# EAGLE design Hydra OSP (EAGLE 8.2.2)
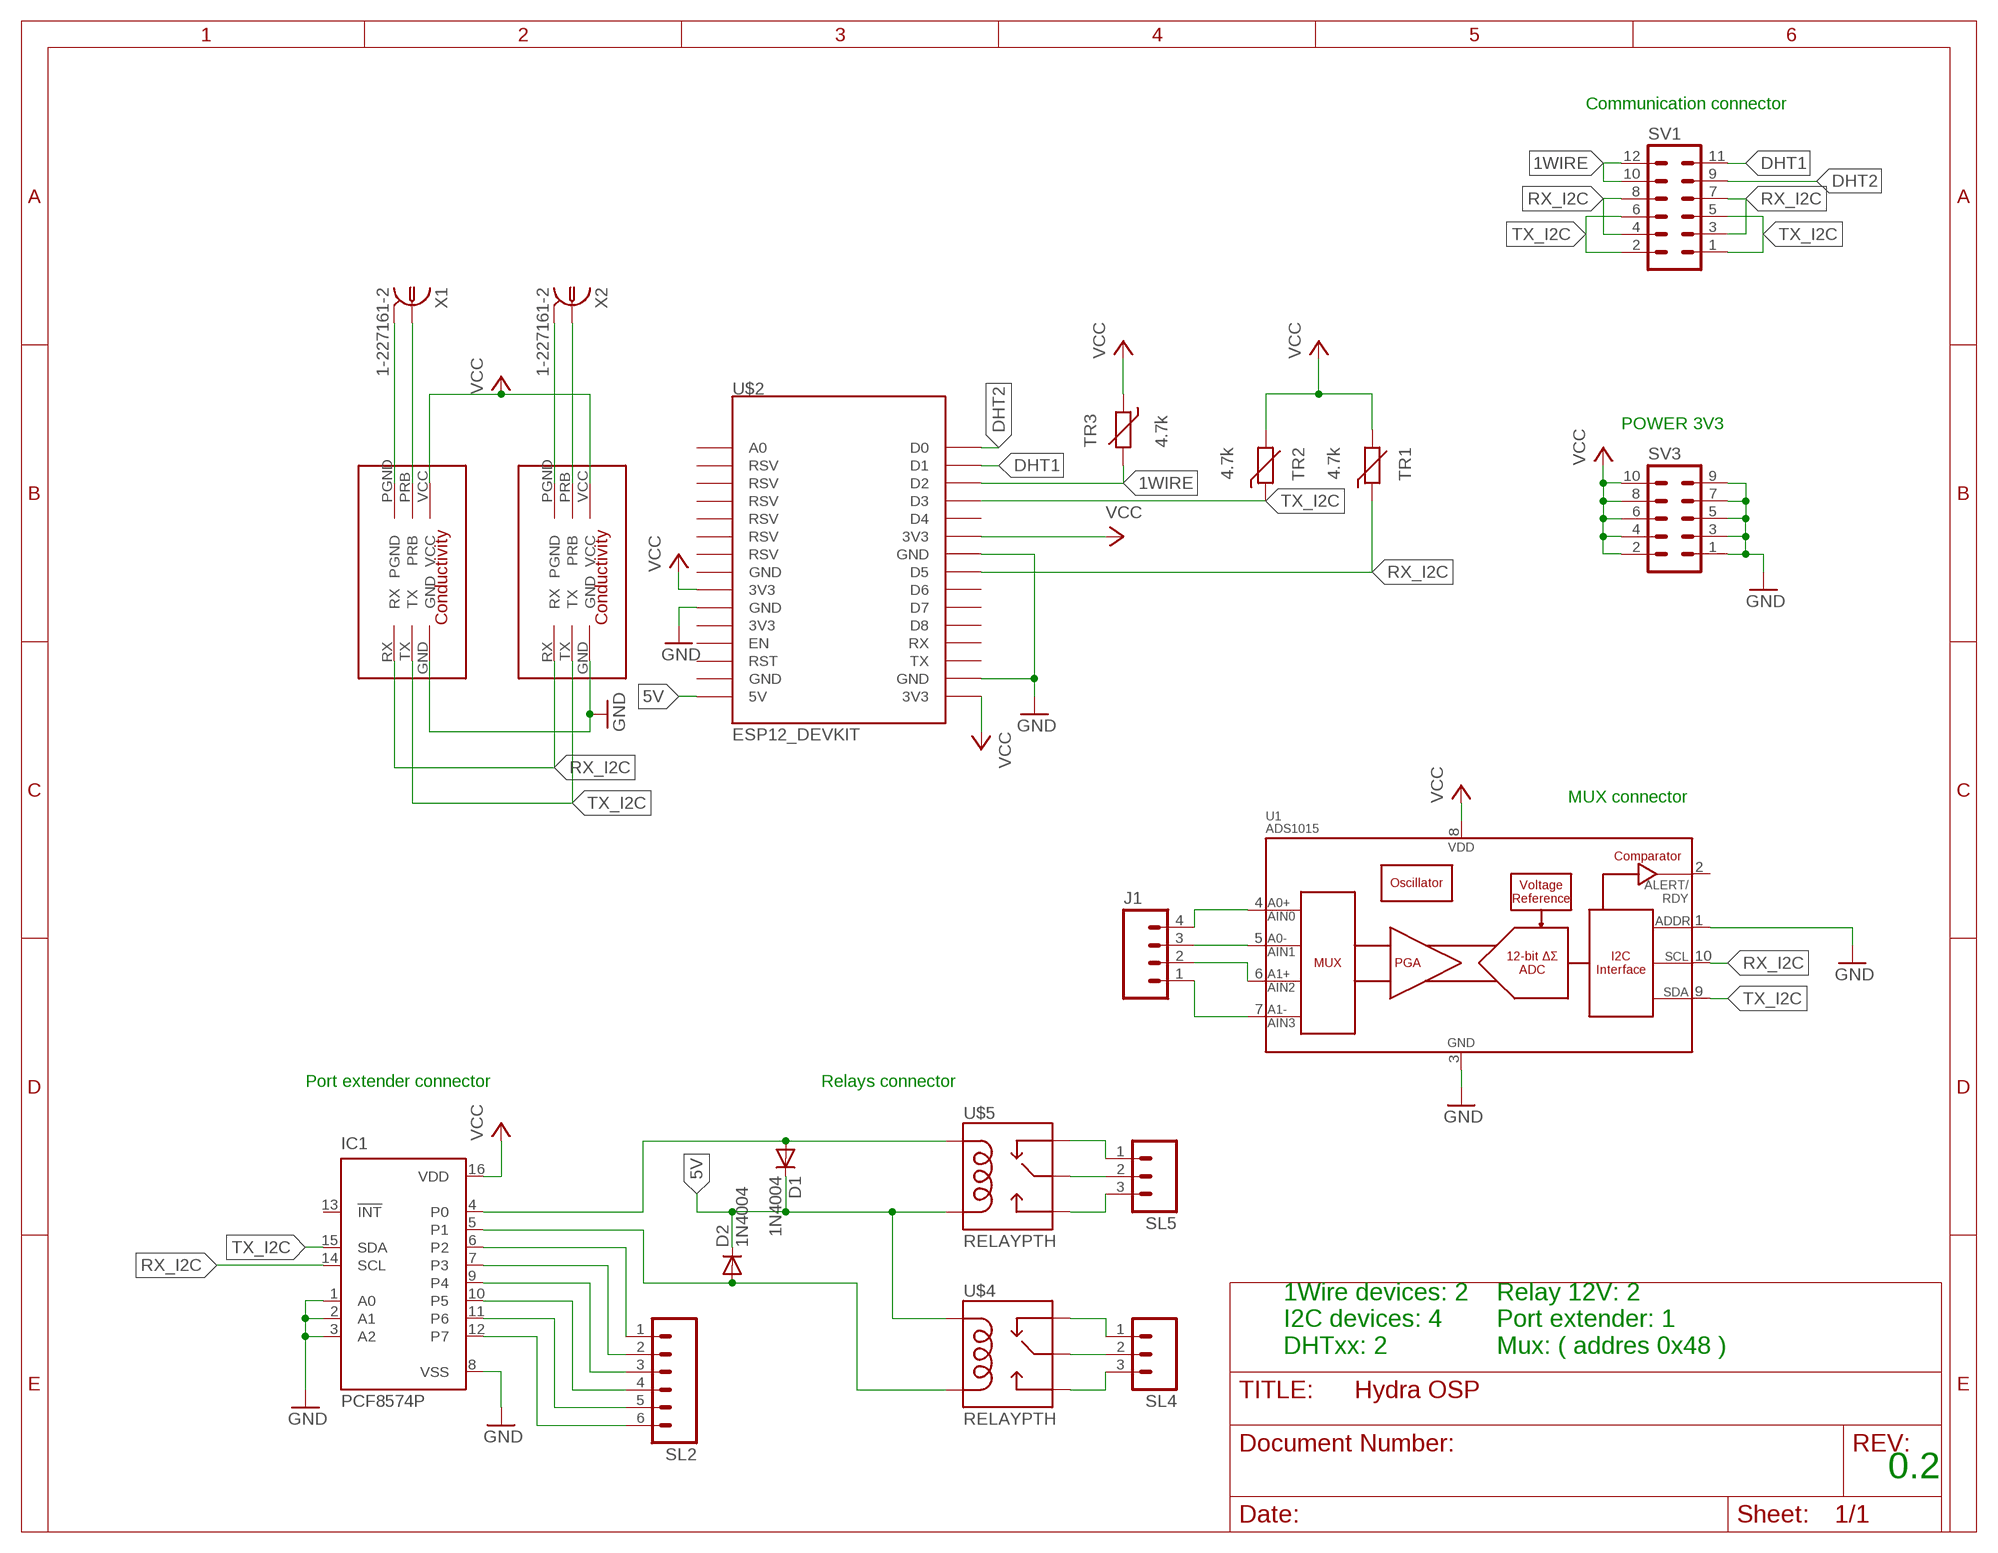
[diagram p0: schematic, sheet 1]

## Parts
D1  1N4004  [DO41-10]
D2  1N4004  [DO41-10]
IC1  PCF8574P  [DIL16]
J1  M04LOCK  [1X04_LOCK]
SL2  M06  [06P]
SL4  M03  [03P]
SL5  M03  [03P]
SV1  MA06-2  [MA06-2]
SV3  MA05-2  [MA05-2]
TR1  4.7k  THERMISTOR_R-5  [R-5]
TR2  4.7k  THERMISTOR_R-5  [R-5]
TR3  4.7k  THERMISTOR_R-5  [R-5]
U1  ADS1015  [MSOP10]
U$1  ATLSCI_COND  [ATLAS_SCI_COND]
U$2  ESP12_DEVKIT  [ESP12_DEVKIT]
U$3  ATLSCI_COND  [ATLAS_SCI_COND]
U$4  RELAYPTH  [SRD-05VDC-SL-C]
U$5  RELAYPTH  [SRD-05VDC-SL-C]
X1  1-227161-2  [AMP_227161]
X2  1-227161-2  [AMP_227161]

## Nets
1WIRE: SV1.10 SV1.12 TR3.2 U$2.D2
5V: D1.C D2.C U$2.5V U$4.COIL1 U$5.COIL0
DHT1: SV1.11 U$2.D1
DHT2: SV1.9 U$2.D0
GND: IC1.1(A0) IC1.2(A1) IC1.3(A2) IC1.8(VSS) SV3.1 SV3.3 SV3.5 SV3.7 SV3.9 U1.1(ADDR) U1.3(VSS) U$1.GND U$2.GND@0(GND) U$2.GND@2(GND) U$2.GND@3(GND) U$3.GND
N$1: U$1.PGND X1.2
N$2: U$1.PRB X1.1
N$3: U$3.PRB X2.1
N$4: U$3.PGND X2.2
N$5: D1.A IC1.4(P0) U$5.COIL1
N$6: D2.A IC1.5(P1) U$4.COIL0
N$7: SL4.1 U$4.SWCLOSED(SWCLOSE)
N$8: SL4.2 U$4.SWCOMMON
N$9: J1.4 U1.4(AIN0)
N$10: J1.3 U1.5(AIN1)
N$11: J1.2 U1.6(AIN2)
N$12: J1.1 U1.7(AIN3)
N$13: IC1.6(P2) SL2.1
N$14: IC1.7(P3) SL2.2
N$15: IC1.9(P4) SL2.3
N$16: IC1.10(P5) SL2.4
N$17: IC1.11(P6) SL2.5
N$18: IC1.12(P7) SL2.6
N$19: SL4.3 U$4.SWOPEN
N$20: SL5.1 U$5.SWCLOSED(SWCLOSE)
N$21: SL5.2 U$5.SWCOMMON
N$22: SL5.3 U$5.SWOPEN
RX_I2C: IC1.14(SCL) SV1.3 SV1.4 SV1.7 SV1.8 TR1.1 U1.10(SCL) U$1.RX U$2.D5 U$3.RX
TX_I2C: IC1.15(SDA) SV1.1 SV1.2 SV1.5 SV1.6 TR2.1 U1.9(SDA) U$1.TX U$2.D3 U$3.TX
VCC: IC1.16(VDD) SV3.2 SV3.4 SV3.6 SV3.8 SV3.10 TR1.2 TR2.2 TR3.1 U1.8(VDD) U$1.VCC U$2.3V3@1(3V3) U$2.3V3@2(3V3) U$2.3V3@3(3V3) U$3.VCC
Unconnected: IC1.13(!INT) U1.2(ALERT/RDY) U$2.3V3@0(3V3) U$2.A0 U$2.D4 U$2.D6 U$2.D7 U$2.D8 U$2.EN U$2.GND@1(GND) U$2.GND@4(GND) U$2.RST U$2.RSV@0(RSV) U$2.RSV@1(RSV) U$2.RSV@2(RSV) U$2.RSV@3(RSV) U$2.RSV@4(RSV) U$2.RSV@5(RSV) U$2.RX U$2.TX

## Notes on the sheet
- Communication connector
- POWER 3V3
- MUX connector
- Port extender connector | Relays connector
- 1Wire devices: 2
  I2C devices: 4
  DHTxx: 2
- Relay 12V: 2
  Port extender: 1
  Mux: ( addres 0x48 )
- 0.2

## Library data of the parts
D1 D2 = diode:1N4004: DIODE general purpose rectifier, 1 A
IC1 = micro-philips:PCF8574: I2C-Bus Remote 8-bit I/O expander http://www.semiconductors.philips.com/acrobat_download/datasheets/PCF8574_4.pdf; MPN: PCF8574PN; OC_FARNELL: 204020; OC_NEWARK: 11N8515
J1 = SparkFun-Connectors:M04: Header 4 Standard 4-pin 0.1" header. Use with straight break away headers (SKU : PRT-00116), right angle break away headers (PRT-00553), swiss pins (PRT-00743), machine pins (PRT-00117), and female headers (PRT-00115). Molex polarized connector foot print use with SKU : PRT-08231 with associated crimp pins and housings. 1MM SMD Version SKU: PRT-10208; PROD_ID: CONN-09696
SL2 = con-amp-quick:M06: AMP QUICK CONNECTOR; OC_FARNELL: unknown; OC_NEWARK: unknown
SL4 SL5 = con-amp-quick:M03: AMP QUICK CONNECTOR; OC_FARNELL: unknown; OC_NEWARK: unknown
SV1 = con-lstb:MA06-2: PIN HEADER; OC_FARNELL: unknown; OC_NEWARK: unknown
SV3 = con-lstb:MA05-2: PIN HEADER; OC_FARNELL: unknown; OC_NEWARK: unknown
TR1-TR3 = discrete:THERMISTOR_: Thermo Resistor
U1 = SparkFun-AnalogIC:ADS1015: 12-Bit Del-Sig ADC Four single-ended inputs or two differential inputs Internal PGA I2C interface 2.0-5.5V; PROD_ID: IC-12239
U$1 U$3 = cond:ATLSCI_COND
U$2 = ESP12_DEVKIT:ESP12_DEVKIT: ESP12 DEVKIT BOARD
U$4 U$5 = SRD-05VDC-SL-C:RELAY: SPDT relay (COM-00101)
X1 X2 = con-coax:?227161*: JACK, RIGHT ANGLE, 50 OHM, PCB, BNC Source: amp_227161.pdf; OC_FARNELL: unknown; OC_NEWARK: unknown

## Board
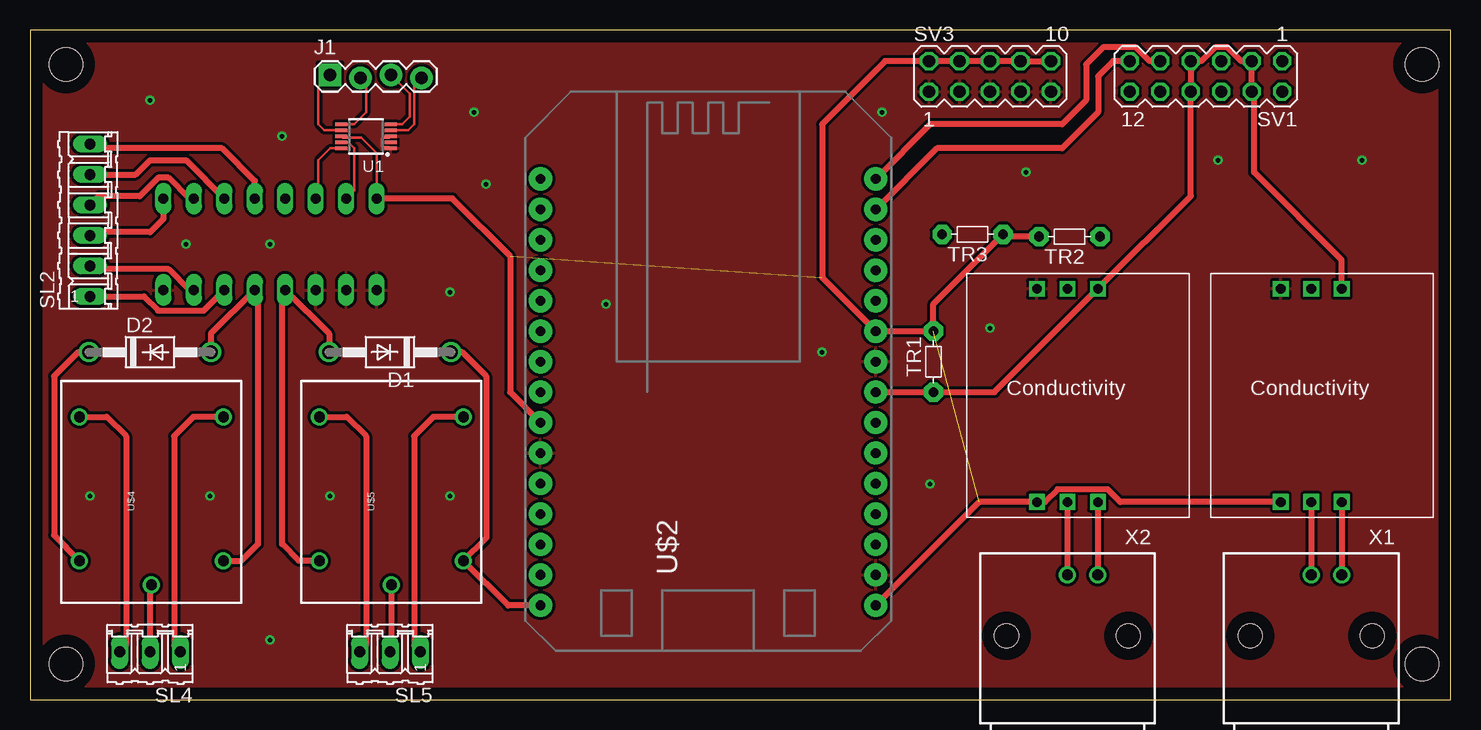
[diagram p1: board, top side]
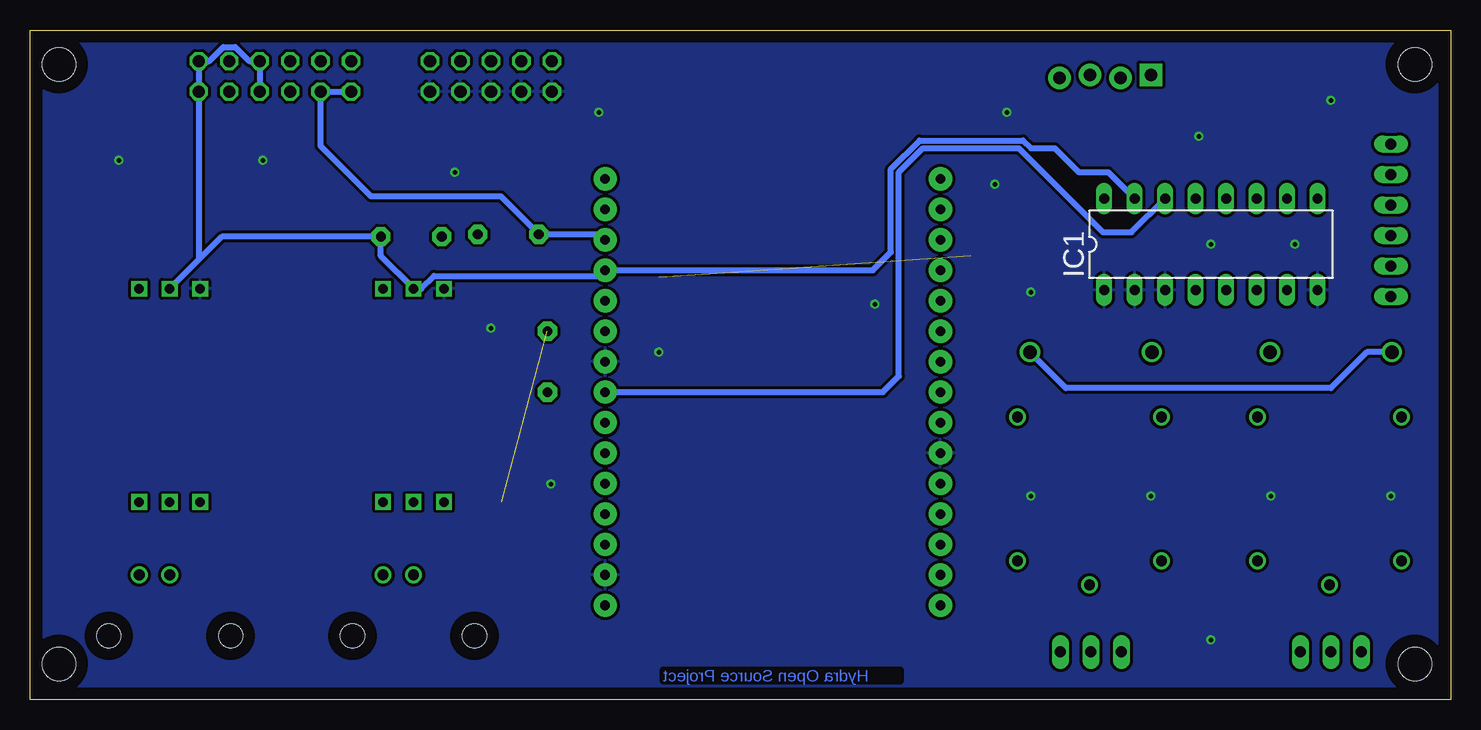
[diagram p2: board, bottom side, seen from below]

Size 118.41 x 55.87 mm. Coordinates in mm from the lower left corner, seen from the top.
Outline: 0,0 118.41,0 118.41,55.87 0,55.87 0,0
Copper layers (1*16): Top 0.035mm / dielectric 1.5mm / Bottom 0.035mm
Design rules "default": minimum track width 6mil, minimum drill 0.35mm, track to track 6mil, track to pad 6mil, pad to pad 6mil, via to via 6mil, smd to smd 6mil, copper to edge 40mil, drill to drill 6mil, minimum pad ring 10mil, minimum via ring 8mil, stop-mask expansion 4mil, vias tented up to drill 0mil, thermal gap 10mil
Holes 2.8 mm at 3,53 3,3 116,3 116,53

### Footprints (pad centres in the part's own frame; a part is rotated, then mirrored left to right if it is on the bottom)
DO41-10 = drill 1.118: A 5.08,0; C -5.08,0
DIL16 = drill 0.813 long: 1 -8.89,-3.81; 2 -6.35,-3.81; 3 -3.81,-3.81; 4 -1.27,-3.81; 5 1.27,-3.81; 6 3.81,-3.81; 7 6.35,-3.81; 8 8.89,-3.81; 9 8.89,3.81; 10 6.35,3.81; 11 3.81,3.81; 12 1.27,3.81; 13 -1.27,3.81; 14 -3.81,3.81; 15 -6.35,3.81; 16 -8.89,3.81
1X04_LOCK = drill 1.016 pad 1.88 square: 1 0,0.127 | drill 1.016 pad 1.88: 2 2.54,-0.127; 3 5.08,0.127; 4 7.62,-0.127
06P = drill 0.914 long: 1 -6.35,0; 2 -3.81,0; 3 -1.27,0; 4 1.27,0; 5 3.81,0; 6 6.35,0
03P = drill 0.914 long: 1 -2.54,0; 2 0,0; 3 2.54,0
MA06-2 = drill 1.016 octagon: 1 -6.35,-1.27; 2 -6.35,1.27; 3 -3.81,-1.27; 4 -3.81,1.27; 5 -1.27,-1.27; 6 -1.27,1.27; 7 1.27,-1.27; 8 1.27,1.27; 9 3.81,-1.27; 10 3.81,1.27; 11 6.35,-1.27; 12 6.35,1.27
MA05-2 = drill 1.016 octagon: 1 -5.08,-1.27; 2 -5.08,1.27; 3 -2.54,-1.27; 4 -2.54,1.27; 5 0,-1.27; 6 0,1.27; 7 2.54,-1.27; 8 2.54,1.27; 9 5.08,-1.27; 10 5.08,1.27
R-5 = drill 0.813 pad 1.6 octagon: 1 -2.54,0; 2 2.54,0
MSOP10 = smd 0.3 x 1: 1 -1,-2.05; 2 -0.5,-2.05; 3 0,-2.05; 4 0.5,-2.05; 5 1,-2.05; 6 1,2.05; 7 0.5,2.05; 8 0,2.05; 9 -0.5,2.05; 10 -1,2.05
ATLAS_SCI_COND = drill 0.8 square: GND -2.54,8.89; PGND 2.54,-8.89; PRB 0,-8.89; RX 2.54,8.89; TX 0,8.89; VCC -2.54,-8.89
ESP12_DEVKIT = drill 0.8 pad 1.93: 3V3@0 -13.97,-7.62; 3V3@1 13.97,5.08; 3V3@2 13.97,-17.78; 3V3@3 -13.97,-2.54; 5V -13.97,-17.78; A0 -13.97,17.78; D0 13.97,17.78; D1 13.97,15.24; D2 13.97,12.7; D3 13.97,10.16; D4 13.97,7.62; D5 13.97,0; D6 13.97,-2.54; D7 13.97,-5.08; D8 13.97,-7.62; EN -13.97,-10.16; GND@0 -13.97,-5.08; GND@1 -13.97,-15.24; GND@2 13.97,2.54; GND@3 13.97,-15.24; GND@4 -13.97,0; RST -13.97,-12.7; RSV@0 -13.97,15.24; RSV@1 -13.97,12.7; RSV@2 -13.97,10.16; RSV@3 -13.97,7.62; RSV@4 -13.97,5.08; RSV@5 -13.97,2.54; RX 13.97,-10.16; TX 13.97,-12.7
SRD-05VDC-SL-C = drill 0.9: COIL0 -5.39,-6.12; COIL1 -5.39,5.88; SWCLOSED 6.61,-6.12; SWCOMMON -7.39,-0.12; SWOPEN 6.61,5.88
AMP_227161 = drill 0.9 pad 1.27: 1 0,-5.08; 2 -2.54,-5.08 | hole 2: -5.08,0; 5.08,0

### Placement (x,y rotation side)
D1  30,29 180 top
D2  10,29 0 top
IC1  20,38 0 bottom
J1  25,52 0 top
SL2  5,40 90 top
SL4  10,4 180 top
SL5  30,4 180 top
SV1  98,52 180 top
SV3  80,52 0 top
TR1  75.29,28.21 90 top
TR2  86.63,38.64 180 top
TR3  78.55,38.83 180 top
U1  28,47 90 top
U$1  106.77,25.4 0 top
U$2  56.51,25.67 0 top
U$3  86.45,25.4 0 top
U$4  10,17 90 top
U$5  30,17 90 top
X1  106.77,5.35 180 top
X2  86.45,5.35 180 top

### Tracks (layer width: path | path; a pad name or v marks a point on that pad's centre or on a via)
1WIRE
  Bottom 0.508: 90,42 91.65,43.65 | 90,42 79.18,42 TR3.2 70.94,38.83 U$2.D2 | 90,42 94.19,46.19 SV1.10 SV1.12
5V
  Top 0.508: D1.C 36,29 38,27 38,13.49 U$5.COIL0 39.84,7.89 U$2.5V | D2.C 4,29 2,27 2,13.73 U$4.COIL1
  Bottom 0.508: D2.C 7,29 10,26 32.08,26 D1.C
DHT1
  Top 0.508: SV1.11 90.27,53.27 89,52 89,49 86,46 75.57,46 U$2.D1
DHT2
  Top 0.508: SV1.9 93.3,53.27 92.13,54.44 89.44,54.44 88,53 88,50 86,48 75.03,48 U$2.D0
GND  (via drill 0.35)
  Top 0.203: U1.3 29.95,46.9 29.45,46.9 29.3,46.76 29.3,46.24 29.45,46.1 29.95,46.1 U1.1
  other vias: 20,5 15,17 5,17 35,17 25,17 35,34 38,43 37,49 21,47 10,50 13,38 20,38 48,33 66,29 75,18 80,31 71,49 83,44 99,45 111,45
  pour Top (isolate 0.254): 0,56 0,0 119,0 119,56
  pour Bottom (isolate 0.254): 0,56 0,0 119,0 119,56
N$1
  Top 0.508: U$1.PGND X1.2
N$2
  Top 0.508: U$1.PRB X1.1
N$3
  Top 0.508: U$3.PRB X2.1
N$4
  Top 0.508: U$3.PGND X2.2
N$5
  Top 0.508: U$5.COIL1 22.39,11.61 21,13 21,33.92 IC1.4 24.92,30.54 D1.A
N$6
  Top 0.508: U$4.COIL0 17.61,11.61 19,13 19,33.92 IC1.5 15.08,30.54 D2.A
N$7
  Top 0.508: U$4.SWCLOSED 13.61,23.61 12,22 12,4.54 SL4.1
N$8
  Top 0.508: SL4.2 10,9.49 U$4.SWCOMMON
N$9
  Top 0.203: U1.4 31.5,47.5 32,48 32,51.25 J1.4
N$10
  Top 0.203: U1.5 31,48 31.64,48.64 31.64,50.56 J1.3
N$11
  Top 0.203: U1.6 27,48 28,49 28,51.41 J1.2
N$12
  Top 0.203: U1.7 24.5,47.5 24,48 24,51.13 J1.1
N$13
  Top 0.508: SL2.1 9.48,33.65 10.67,32.46 14.46,32.46 IC1.6
N$14
  Top 0.508: IC1.7 13.28,34.19 11.55,35.92 5.27,35.92 SL2.2
N$15
  Top 0.508: IC1.9 11.11,40.11 10,39 5.27,39 SL2.3
N$16
  Top 0.508: IC1.10 13.28,41.81 11.55,43.54 10.67,43.54 9.13,42 5.73,42 SL2.4
N$17
  Top 0.508: SL2.5 8.81,43.81 10,45 13,45 IC1.11
N$18
  Top 0.508: IC1.12 18.73,43.27 16,46 5.35,46 SL2.6
N$19
  Top 0.508: U$4.SWOPEN 6.39,23.61 8,22 8,4.54 SL4.3
N$20
  Top 0.508: U$5.SWCLOSED 33.61,23.61 32,22 32,4.54 SL5.1
N$21
  Top 0.508: U$5.SWCOMMON 30.12,4.12 SL5.2
N$22
  Top 0.508: U$5.SWOPEN 26.39,23.61 28,22 28,4.54 SL5.3
RX_I2C
  Top 0.2: U1.10 25,46 24,45 24,42 IC1.14
  Top 0.508: U$2.D5 TR1.1 80.37,25.67 U$3.RX 96.73,42.03 SV1.8 SV1.7 97.62,53.27 98.79,54.44 99.75,54.44 100.92,53.27 SV1.3 SV1.4 102,50.54 102,44 109.31,36.69 U$1.RX
  Bottom 0.508: U$2.D5 47.33,25.67 46,27 46,44 44,46 36,46 29,39 26.62,39 IC1.14
TX_I2C
  Top 0.2: U1.9 26.5,46.5 27,46 27,42.46 IC1.15
  Bottom 0.508: SV1.6 SV1.5 100.16,53.27 101.33,54.44 102.29,54.44 103.46,53.27 SV1.1 SV1.2 104.35,36.71 | 104.35,36.71 U$1.TX | 104.35,36.71 102.42,38.64 TR2.1 89.17,37.01 U$3.TX 85.79,34.29 84.73,35.35 70.96,35.35 U$2.D3 48.17,35.83 46.66,37.34 46.66,44.27 44.27,46.66 35.66,46.66 35,46 33,46 31,44 28.54,44 IC1.15
VCC  (2 unrouted)
  Top 0.2: IC1.16 28.89,45.61 27.6,46.9 26.05,46.9 U1.8
  Top 0.508: IC1.16 35.19,41.81 40,37 40,25.67 U$2.3V3@3 | U$2.3V3@2 79.1,16.51 U$3.VCC 84.57,16.51 85.63,17.57 89.81,17.57 90.87,16.51 U$1.VCC | SV3.10 SV3.8 SV3.6 SV3.4 SV3.2 71.27,53.27 66,48 66,35.23 U$2.3V3@1 TR1.2 75.29,33.03 80.91,38.65 | 80.91,38.65 TR3.1 | TR2.2 80.93,38.64 80.91,38.65

### Text on the board
Bottom: Hydra Open Source Project